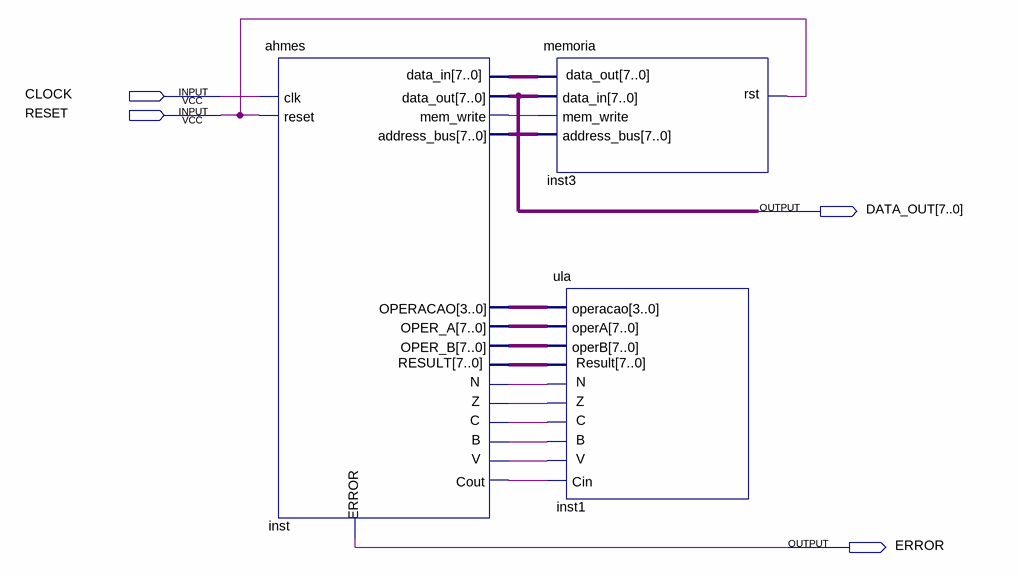
[diagram p0: schematic sheet]
// Quartus schematic CPU.bdf as structural Verilog: 3 symbols, 4 pins
module CPU (
  input  CLOCK,
  input  RESET,
  output [7:0] DATA_OUT,
  output ERROR
);

  wire inst1_b, inst1_c, inst1_n, inst1_v, inst1_z, inst_cout, inst_mem_write;
  wire [3:0] inst_operacao;
  wire [7:0] inst1_result, inst3_data_out, inst_address_bus, inst_oper_a, inst_oper_b;

  ahmes inst (
    .data_in(inst3_data_out), .clk(CLOCK), .reset(RESET), .RESULT(inst1_result), .N(inst1_n), .Z(inst1_z),
    .C(inst1_c), .B(inst1_b), .V(inst1_v), .address_bus(inst_address_bus), .data_out(DATA_OUT),
    .mem_write(inst_mem_write), .OPERACAO(inst_operacao), .OPER_A(inst_oper_a), .OPER_B(inst_oper_b),
    .Cout(inst_cout), .ERROR(ERROR));
  memoria inst3 (
    .address_bus(inst_address_bus), .data_in(DATA_OUT), .mem_write(inst_mem_write), .rst(RESET),
    .data_out(inst3_data_out));
  ula inst1 (
    .operacao(inst_operacao), .operA(inst_oper_a), .operB(inst_oper_b), .Cin(inst_cout),
    .Result(inst1_result), .N(inst1_n), .Z(inst1_z), .C(inst1_c), .B(inst1_b), .V(inst1_v));
endmodule
